# EAGLE design eggbothat3 (EAGLE 7.7.0)

## Sheet 1 of 2
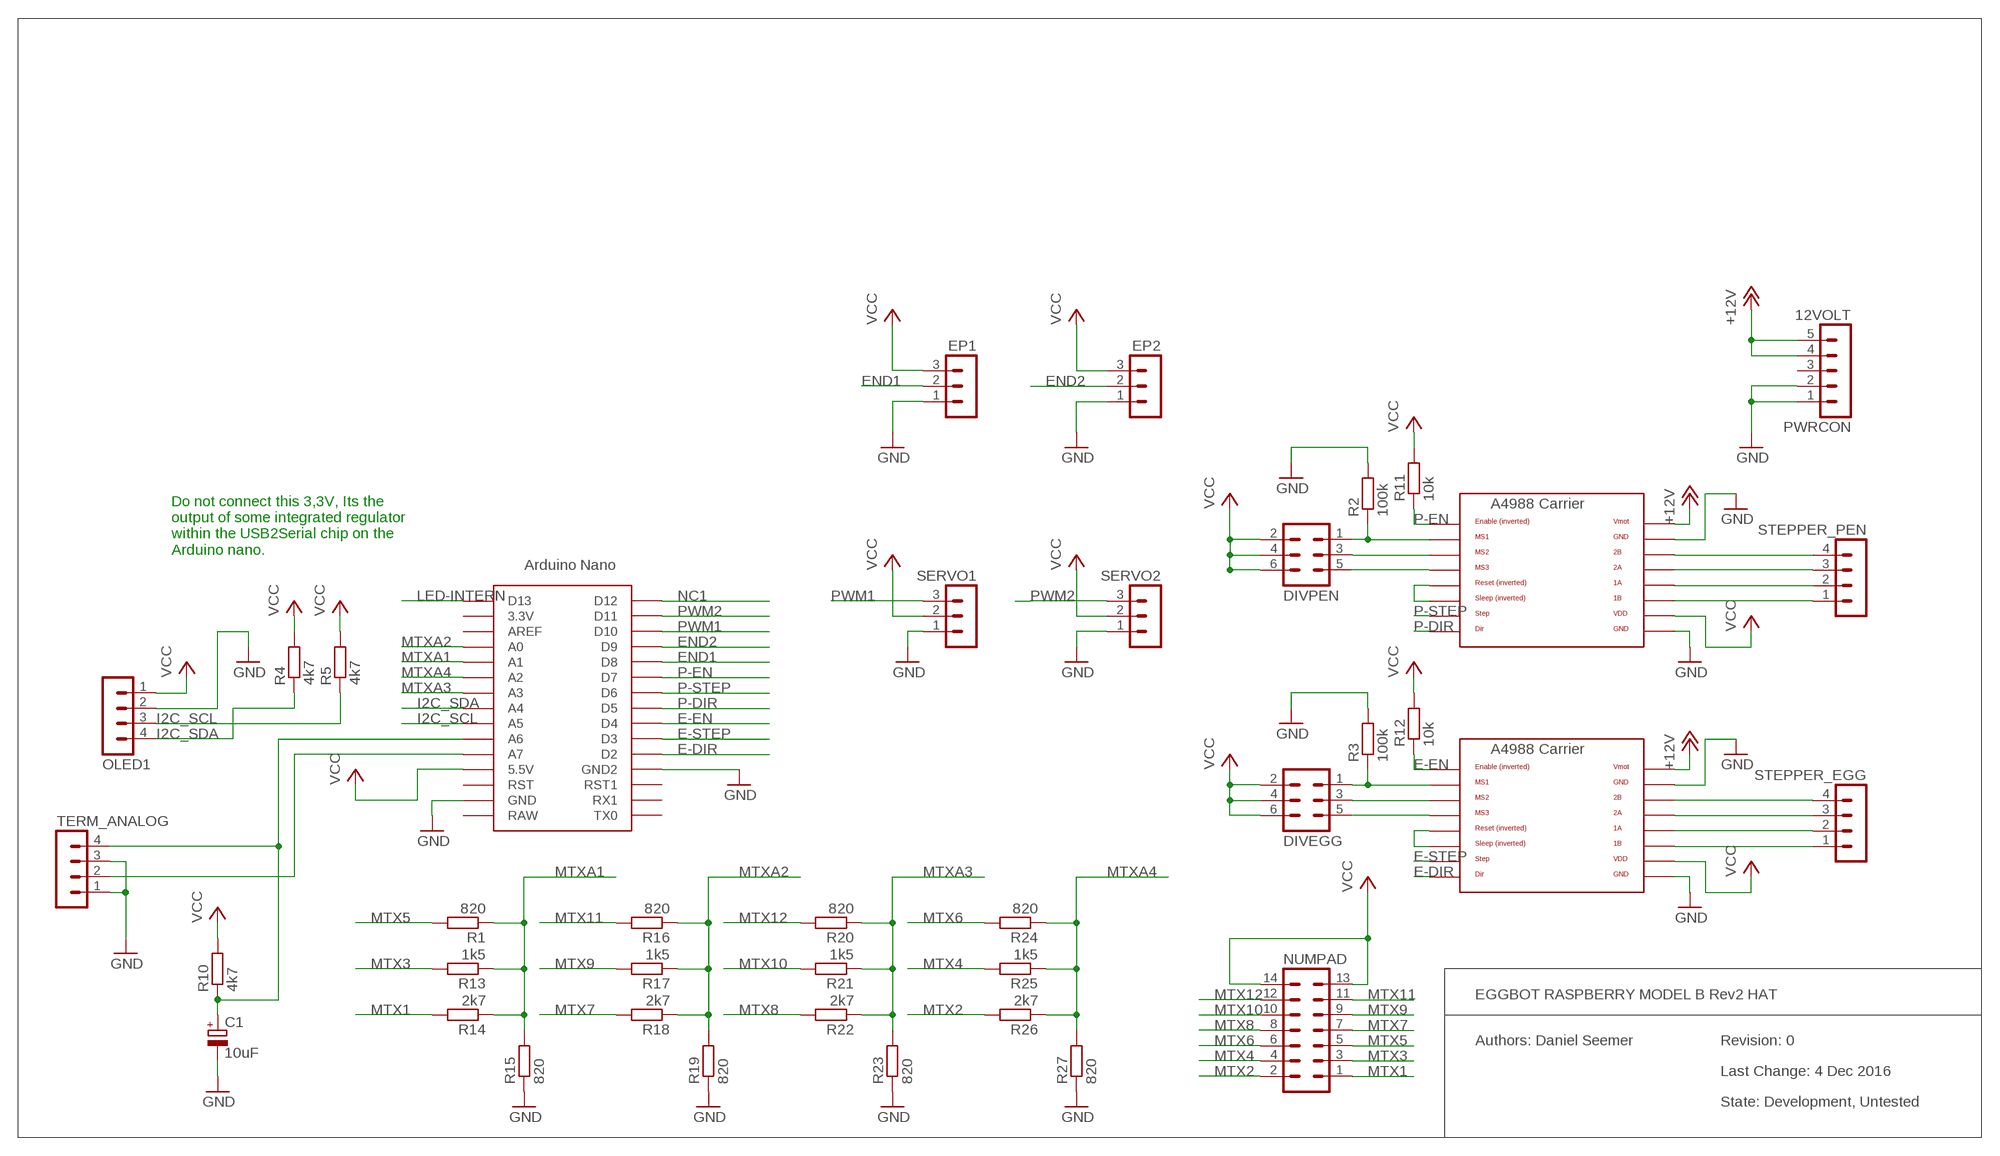
[diagram p0: schematic, sheet 1]

### Parts
12VOLT  PWRCON  MA05-1  [MA05-1]
C1  10uF  CPOL-EUE2.5-5  [E2,5-5]
DIVEGG  MA03-2  [MA03-2]
DIVPEN  MA03-2  [MA03-2]
EP1  MA03-1  [MA03-1]
EP2  MA03-1  [MA03-1]
NUMPAD  MA07-2  [MA07-2]
OLED1  MA04-1  [MA04-1]
R1  820  R-EU_R1206  [R1206]
R2  100k  R-EU_R1206  [R1206]
R3  100k  R-EU_R1206  [R1206]
R4  4k7  R-EU_R1206  [R1206]
R5  4k7  R-EU_R1206  [R1206]
R10  4k7  R-EU_R1206  [R1206]
R11  10k  R-EU_R1206  [R1206]
R12  10k  R-EU_R1206  [R1206]
R13  1k5  R-EU_R1206  [R1206]
R14  2k7  R-EU_R1206  [R1206]
R15  820  R-EU_R1206  [R1206]
R16  820  R-EU_R1206  [R1206]
R17  1k5  R-EU_R1206  [R1206]
R18  2k7  R-EU_R1206  [R1206]
R19  820  R-EU_R1206  [R1206]
R20  820  R-EU_R1206  [R1206]
R21  1k5  R-EU_R1206  [R1206]
R22  2k7  R-EU_R1206  [R1206]
R23  820  R-EU_R1206  [R1206]
R24  820  R-EU_R1206  [R1206]
R25  1k5  R-EU_R1206  [R1206]
R26  2k7  R-EU_R1206  [R1206]
R27  820  R-EU_R1206  [R1206]
SERVO1  MA03-1  [MA03-1]
SERVO2  MA03-1  [MA03-1]
STEPPER_EGG  MA04-1  [MA04-1]
STEPPER_PEN  MA04-1  [MA04-1]
TERM_ANALOG  MA04-1  [MA04-1]
U$1  A4988BREAKOUT  [A4988BREAKOUT]
U$2  A4988BREAKOUT  [A4988BREAKOUT]
U$4  NANO  [NANO]

### Nets
+12V: 12VOLT.4 12VOLT.5 U$1.VMOT U$2.VMOT
E-DIR: U$2.DIR U$4.D2
E-EN: R12.1 U$2.EN U$4.D4
E-STEP: U$2.STEP U$4.D3
END1: EP1.2 U$4.D8
END2: EP2.2 U$4.D9
GND: 12VOLT.1 12VOLT.2 C1.- EP1.1 EP2.1 OLED1.2 R2.2 R3.2 R15.1 R19.1 R23.1 R27.1 SERVO1.1 SERVO2.1 TERM_ANALOG.1 TERM_ANALOG.3 U$1.GND U$1.GND@0(GND) U$2.GND U$2.GND@0(GND) U$4.GND U$4.GND1(GND2)
I2C_SCL: OLED1.3 R5.1 U$4.A5
I2C_SDA: OLED1.4 R4.1 U$4.A4
LED-INTERN: U$4.D13
MTX1: NUMPAD.1 R14.2
MTX2: NUMPAD.2 R26.2
MTX3: NUMPAD.3 R13.2
MTX4: NUMPAD.4 R25.2
MTX5: NUMPAD.5 R1.2
MTX6: NUMPAD.6 R24.2
MTX7: NUMPAD.7 R18.2
MTX8: NUMPAD.8 R22.2
MTX9: NUMPAD.9 R17.2
MTX10: NUMPAD.10 R21.2
MTX11: NUMPAD.11 R16.2
MTX12: NUMPAD.12 R20.2
MTXA1: R1.1 R13.1 R14.1 R15.2 U$4.A1
MTXA2: R16.1 R17.1 R18.1 R19.2 U$4.A0
MTXA3: R20.1 R21.1 R22.1 R23.2 U$4.A3
MTXA4: R24.1 R25.1 R26.1 R27.2 U$4.A2
N$1: STEPPER_PEN.4 U$1.2B
N$2: STEPPER_PEN.3 U$1.2A
N$3: STEPPER_PEN.2 U$1.1A
N$4: STEPPER_PEN.1 U$1.1B
N$5: STEPPER_EGG.4 U$2.2B
N$6: STEPPER_EGG.3 U$2.2A
N$7: STEPPER_EGG.2 U$2.1A
N$8: STEPPER_EGG.1 U$2.1B
N$9: DIVPEN.3 U$1.MS2
N$10: DIVPEN.1 R2.1 U$1.MS1
N$11: DIVPEN.5 U$1.MS3
N$12: DIVEGG.3 U$2.MS2
N$13: DIVEGG.1 R3.1 U$2.MS1
N$14: DIVEGG.5 U$2.MS3
N$18: U$1.RST U$1.SLP(SLEEP)
N$19: U$2.RST U$2.SLP(SLEEP)
N$20: C1.+ R10.1 TERM_ANALOG.4 U$4.A6
N$21: TERM_ANALOG.2 U$4.A7
NC1: U$4.D12
P-DIR: U$1.DIR U$4.D5
P-EN: R11.1 U$1.EN U$4.D7
P-STEP: U$1.STEP U$4.D6
PWM1: SERVO1.3 U$4.D10
PWM2: SERVO2.3 U$4.D11
VCC: DIVEGG.2 DIVEGG.4 DIVEGG.6 DIVPEN.2 DIVPEN.4 DIVPEN.6 EP1.3 EP2.3 NUMPAD.13 NUMPAD.14 OLED1.1 R4.2 R5.2 R10.2 R11.2 R12.2 SERVO1.2 SERVO2.2 U$1.VDD U$2.VDD U$4.5V(5.5V)
Unconnected: 12VOLT.3 U$4.3.3V U$4.AREF U$4.RAW U$4.RST U$4.RST1 U$4.RX1 U$4.TX0

### Notes on the sheet
- Do not connect this 3,3V, Its the
  output of some integrated regulator
  within the USB2Serial chip on the
  Arduino nano.
- EGGBOT RASPBERRY MODEL B Rev2 HAT
- Authors: Daniel Seemer | Revision: 0
- Last Change: 4 Dec 2016
- State: Development, Untested

## Sheet 2 of 2

## Library data of the parts
12VOLT = con-lstb:MA05-1: PIN HEADER; OC_FARNELL: unknown; OC_NEWARK: unknown
C1 = rcl:CPOL-EU: POLARIZED CAPACITOR, European symbol
DIVEGG DIVPEN = con-lstb:MA03-2: PIN HEADER; OC_FARNELL: unknown; OC_NEWARK: unknown
EP1 EP2 SERVO1 SERVO2 = con-lstb:MA03-1: PIN HEADER; OC_FARNELL: unknown; OC_NEWARK: unknown
NUMPAD = con-lstb:MA07-2: PIN HEADER; OC_FARNELL: unknown; OC_NEWARK: unknown
OLED1 STEPPER_EGG STEPPER_PEN TERM_ANALOG = con-lstb:MA04-1: PIN HEADER; OC_FARNELL: unknown; OC_NEWARK: unknown
R1-R5 R10-R27 = rcl:R-EU_: RESISTOR, European symbol
U$1 U$2 = RepRapjr:A4988BREAKOUT
U$4 = levelshifter:NANO: Arduino Nano

## Board
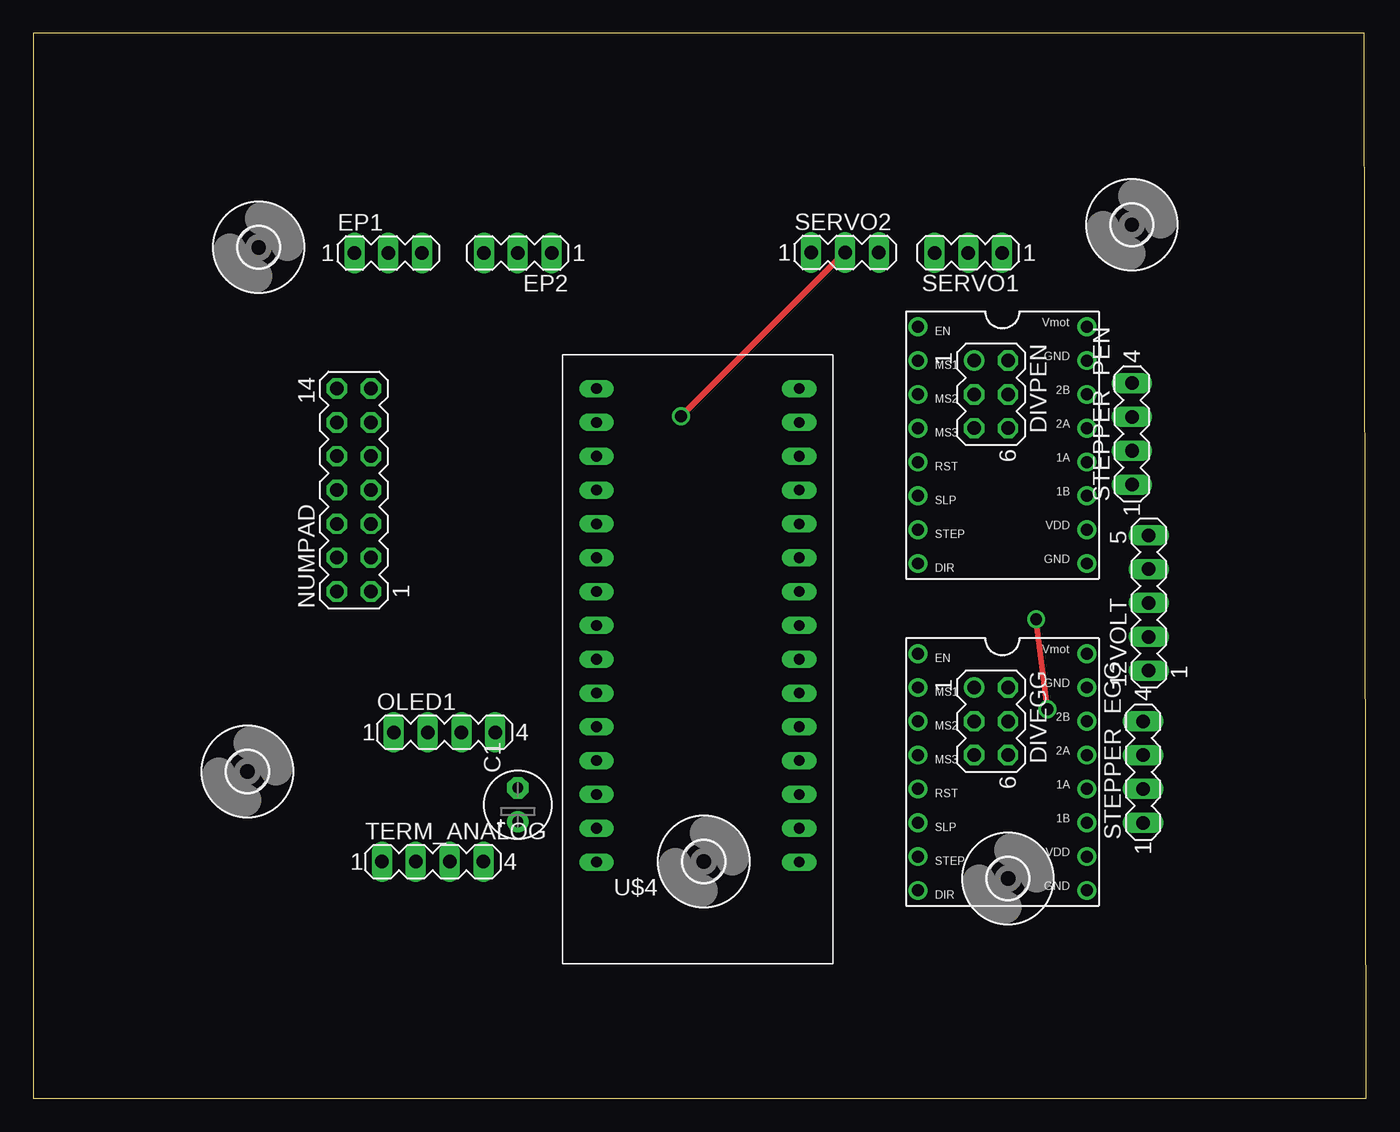
[diagram p1: board, top side]
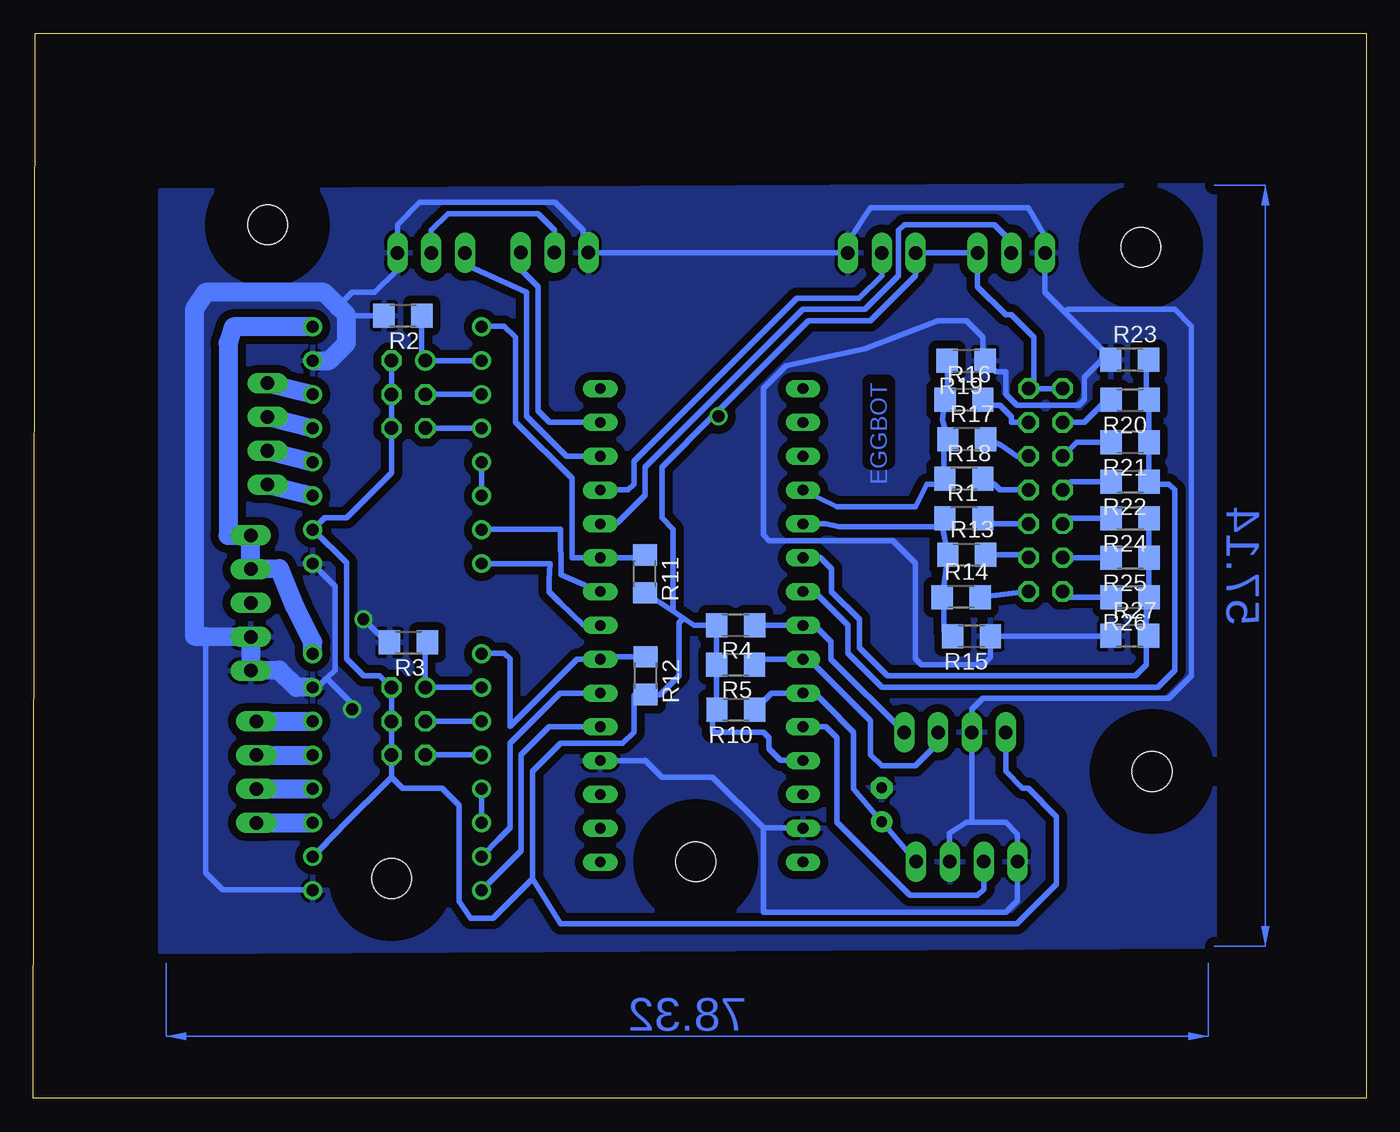
[diagram p2: board, bottom side, seen from below]

Size 100.16 x 80 mm. Coordinates in mm from the lower left corner, seen from the top.
Outline: 0,0 100.16,0 100,80 0,80 0,0
Copper layers (1*16): Top 0.035mm / dielectric 1.5mm / Bottom 0.035mm
Design rules "default": minimum track width 10mil, minimum drill 24mil, track to track 8mil, track to pad 8mil, pad to pad 8mil, via to via 8mil, smd to smd 8mil, copper to edge 40mil, drill to drill 8mil, minimum pad ring 10mil, minimum via ring 8mil, stop-mask expansion 4mil, vias tented up to drill 0mil, thermal gap 10mil

### Footprints (pad centres in the part's own frame; a part is rotated, then mirrored left to right if it is on the bottom)
MA05-1 = drill 1.016 long: 1 -5.08,0; 2 -2.54,0; 3 0,0; 4 2.54,0; 5 5.08,0
E2,5-5 = drill 0.813 pad 1.6: + -1.27,0 | drill 0.813 pad 1.6 octagon: - 1.27,0
MA03-2 = drill 1.016: 1 -2.54,-1.27 | drill 1.016 octagon: 2 -2.54,1.27; 3 0,-1.27; 4 0,1.27; 5 2.54,-1.27; 6 2.54,1.27
MA03-1 = drill 1.016 long: 1 -2.54,0; 2 0,0; 3 2.54,0
MA07-2 = drill 1.016 octagon: 1 -7.62,-1.27; 2 -7.62,1.27; 3 -5.08,-1.27; 4 -5.08,1.27; 5 -2.54,-1.27; 6 -2.54,1.27; 7 0,-1.27; 8 0,1.27; 9 2.54,-1.27; 10 2.54,1.27; 11 5.08,-1.27; 12 5.08,1.27; 13 7.62,-1.27; 14 7.62,1.27
MA04-1 = drill 1.016 long: 1 -3.81,0; 2 -1.27,0; 3 1.27,0; 4 3.81,0
R1206 = smd 1.6 x 1.803: 1 -1.422,0; 2 1.422,0
A4988BREAKOUT = drill 0.9: 1A 8.89,1.27; 1B 11.43,1.27; 2A 6.35,1.27; 2B 3.81,1.27; DIR 16.51,-11.43; EN -1.27,-11.43; GND 16.51,1.27; GND@0 1.27,1.27; MS1 1.27,-11.43; MS2 3.81,-11.43; MS3 6.35,-11.43; RST 8.89,-11.43; SLP 11.43,-11.43; STEP 13.97,-11.43; VDD 13.97,1.27; VMOT -1.27,1.27
3,0 = hole 3: 0,0
NANO = drill 0.8 long: 3.3V -10.16,24.13; 5V -10.16,-1.27; A0 -10.16,19.05; A1 -10.16,16.51; A2 -10.16,13.97; A3 -10.16,11.43; A4 -10.16,8.89; A5 -10.16,6.35; A6 -10.16,3.81; A7 -10.16,1.27; AREF -10.16,21.59; D2 5.08,1.27; D3 5.08,3.81; D4 5.08,6.35; D5 5.08,8.89; D6 5.08,11.43; D7 5.08,13.97; D8 5.08,16.51; D9 5.08,19.05; D10 5.08,21.59; D11 5.08,24.13; D12 5.08,26.67; D13 -10.16,26.67; GND -10.16,-6.35; GND1 5.08,-1.27; RAW -10.16,-8.89; RST -10.16,-3.81; RST1 5.08,-3.81; RX1 5.08,-6.35; TX0 5.08,-8.89

### Placement (x,y rotation side)
12VOLT  83.82,37.21 90 top
C1  36.41,22.05 90 top
DIVEGG  71.97,28.32 270 top
DIVPEN  71.97,52.87 270 top
EP1  26.67,63.5 0 top
EP2  36.41,63.5 180 top
NUMPAD  24.09,45.69 90 top
OLED1  30.9,27.5 0 top
R1  30.23,43.58 0 bottom
R2  72.39,58.8 180 bottom
R3  71.97,34.25 180 bottom
R4  47.38,35.55 180 bottom
R5  47.38,32.58 180 bottom
R10  47.36,29.2 180 bottom
R11  54.2,39.4 270 bottom
R12  54.14,31.75 270 bottom
R13  30.02,40.83 0 bottom
R14  30.44,37.65 0 bottom
R15  29.66,34.72 180 bottom
R16  30.23,52.47 0 bottom
R17  30.02,49.5 0 bottom
R18  30.23,46.54 0 bottom
R19  30.06,55.41 180 bottom
R20  17.74,52.47 180 bottom
R21  17.74,49.29 180 bottom
R22  17.74,46.33 180 bottom
R23  17.77,55.48 0 bottom
R24  17.74,43.58 180 bottom
R25  17.74,40.61 180 bottom
R26  17.74,37.65 180 bottom
R27  17.77,34.74 0 bottom
SERVO1  70.25,63.51 180 top
SERVO2  60.99,63.53 0 top
STEPPER_EGG  83.4,24.51 90 top
STEPPER_PEN  82.55,49.91 90 top
TERM_ANALOG  30.01,17.77 0 top
U$1  77.89,56.68 270 top
U$2  77.89,32.13 270 top
U$3  [3,0]  16.93,63.92 0 top
U$4  52.48,26.64 0 top
U$5  [3,0]  82.55,65.62 0 top
U$6  [3,0]  73.24,16.51 0 top
U$7  [3,0]  50.38,17.78 0 top
U$8  [3,0]  16.09,24.55 0 top

### Tracks (layer width: path | path; a pad name or v marks a point on that pad's centre or on a via)
+12V
  Bottom 1.422: U$2.VMOT 79.16,34.29 80.43,36.83 81.66,39.79 12VOLT.4 12VOLT.5 85.51,42.29 85.51,56.73 85.13,57.95 U$1.VMOT
E-DIR
  Bottom 0.406: U$4.D2 61.42,27.91 63.5,25.82 63.5,18.59 U$2.DIR
E-EN
  Bottom 0.406: R12.1 57.38,33.17 U$4.D4 59.3,32.99 64.35,27.94 64.31,29.6 64.35,32.6 64.35,33.02 64.77,33.44 66.42,33.44 U$2.EN
E-STEP
  Bottom 0.406: U$4.D3 60.57,30.45 64.35,26.67 64.35,20.32 65.19,19.47 66.42,18.2 U$2.STEP
END1
  Bottom 0.406: U$4.D8 57.53,43.18 56.3,43.18 54.19,45.3 54.19,47.41 42.33,59.27 37.68,59.27 35.14,61.81 35.14,65.19 34.71,65.62 27.94,65.62 26.67,64.35 EP1.2
END2
  Bottom 0.406: EP2.2 36.41,61.81 38.1,60.11 42.76,60.11 55.03,47.84 55.03,46.14 55.46,45.72 57.53,45.72 U$4.D9
GND  (via drill 0.9)
  Top 0.406: v75.35,35.98 v76.2,29.21
  Bottom 0.406: R27.1 19.47,34.7 28.78,34.7 R15.1 28.23,33.13 28.78,32.59 33.43,32.59 33.86,33.01 33.86,40.2 35.55,41.9 44.86,41.9 45.3,42.33 45.3,53.34 43.6,55.03 37.68,56.3 32.17,58.42 30.06,58.42 28.79,57.15 28.79,55.56 R19.1 27.82,54.59 27.09,54.59 27.09,52.9 26.24,52.05 21.59,52.05 21.16,52.48 21.16,54.17 19.85,55.48 | R23.1 19.85,55.48 | 30.05,20.74 29.63,20.75 OLED1.2 29.63,29.21 29.21,29.63 | 30.05,20.74 31.32,19.93 TERM_ANALOG.3 | 30.05,20.74 27.09,20.74 26.2,19.85 TERM_ANALOG.1 26.2,14.86 27.09,13.97 45.3,13.97 45.3,20.32 | U$1.GND 77.47,38.48 77.47,32.17 78.11,31.54 | 78.11,31.54 78.78,30.86 U$2.GND@0 | 45.3,20.32 49.11,24.13 52.92,24.13 54.19,25.4 54.22,25.37 U$4.GND1 57.6,25.4 | U$2.GND 79.21,15.66 85.94,15.66 87.2,16.93 87.2,34.7 | U$4.GND 42.36,20.32 45.3,20.32 | 77.26,59.48 76.2,60.54 74.51,60.54 72.8,62.25 SERVO1.1 72.8,65.64 71.12,67.31 60.96,67.31 58.84,65.19 58.84,63.92 SERVO2.1 58.42,63.5 EP2.1 | R2.2 76.58,58.8 76.62,58.84 | EP2.1 38.95,64.35 37.25,66.89 25.4,66.89 24.13,64.77 EP1.1 24.13,60.54 22.65,59.05 | EP2.1 | 19.85,55.48 19.85,56.26 22.65,59.05 | 29.21,29.63 | 29.21,29.63 28.79,30.06 14.82,30.06 13.12,31.75 13.12,58 14.39,59.27 22.44,59.27 22.65,59.05 | v75.35,35.98 73.66,34.29 R3.2 | v76.2,29.21 76.2,29.63 78.11,31.54
  Bottom 1.422: U$2.GND@0 80.39,30.86 81.7,32.17 81.66,32.17 12VOLT.1 12VOLT.2 87.2,34.7 88.05,34.71 88.05,59.27 87.21,60.54 78.32,60.54 77.26,59.48 76.62,58.84 76.62,56.73 77.94,55.41 U$1.GND@0
  pour Bottom (isolate 0.61): 11.43,68.58 11.43,11.43 90.59,11.01 90.59,68.16
I2C_SCL
  Bottom 0.406: OLED1.3 32.16,27.49 32.16,26.66 33.86,24.97 36.4,24.97 37.24,25.82 37.24,28.36 41.9,33.01 41.92,32.99 U$4.A5 45.56,32.99 R5.1
I2C_SDA
  Bottom 0.406: OLED1.4 40.21,32.99 40.21,34.28 41.45,35.53 U$4.A4 45.94,35.53 R4.1
MTX1
  Bottom 0.406: R14.2 NUMPAD.1
MTX2
  Bottom 0.406: R26.2 22.82,37.65 NUMPAD.2
MTX3
  Bottom 0.406: R13.2 25.57,40.83 NUMPAD.3
MTX4
  Bottom 0.406: R25.2 NUMPAD.4 | NUMPAD.4
MTX5
  Bottom 0.406: R1.2 27.92,43.15 27.09,43.17 25.37,43.17 NUMPAD.5
MTX6
  Bottom 0.406: R24.2 22.4,43.58 NUMPAD.6
MTX7
  Bottom 0.406: R18.2 27.92,46.12 27.93,46.13 27.51,45.71 25.77,45.71 NUMPAD.7
MTX8
  Bottom 0.406: R22.2 22.18,46.33 NUMPAD.8
MTX9
  Bottom 0.406: R17.2 27.5,49.08 26.24,48.24 25.37,48.24 NUMPAD.9
MTX10
  Bottom 0.406: R21.2 21.76,49.29 NUMPAD.10
MTX11
  Bottom 0.406: NUMPAD.11 26.65,50.77 26.66,50.78 26.66,51.21 27.51,52.05 28.39,52.05 R16.2
MTX12
  Bottom 0.406: R20.2 19.48,52.47 21.16,50.78 22.81,50.78 NUMPAD.12
MTXA1
  Bottom 0.406: 31.86,42.94 R13.1 R14.1 31.74,37.24 31.74,35.13 R15.2 | 31.86,42.94 R1.1 | 31.86,42.94 39.58,42.94 40.63,43.17 42.3,43.17 U$4.A1
MTXA2
  Bottom 0.406: 31.74,46.13 31.74,48.67 R17.1 31.86,50.99 R16.1 31.48,52.64 R19.2 | 31.74,46.13 R18.1 | 31.74,46.13 33.01,46.13 33.86,44.44 39.76,44.44 U$4.A0
MTXA3
  Bottom 0.406: R21.1 R22.1 16.12,46.13 14.81,46.13 14.39,45.71 14.39,32.16 15.66,30.89 36.4,30.89 38.94,33.44 38.94,35.55 41.45,38.07 U$4.A3 | R21.1 | R21.1 R20.1 | R20.1 | R23.2 16.51,55.44 16.51,52.48 R20.1
MTXA4
  Bottom 0.406: R24.1 R25.1 R26.1 16.51,37.24 16.51,35.13 R27.2 16.51,34.58 16.51,32.59 17.35,31.74 35.97,31.74 38.09,33.86 38.09,35.97 40.19,38.07 40.19,39.76 41.06,40.64 U$4.A2 | R24.1
N$1
  Bottom 0.406: U$1.2B
  Bottom 1.422: STEPPER_PEN.4 U$1.2B
N$2
  Bottom 0.406: U$1.2A
  Bottom 1.422: STEPPER_PEN.3 U$1.2A
N$3
  Bottom 0.406: U$1.1A
  Bottom 1.422: STEPPER_PEN.2 U$1.1A
N$4
  Bottom 0.406: U$1.1B
  Bottom 1.422: STEPPER_PEN.1 U$1.1B
N$5
  Bottom 0.406: U$2.2B
  Bottom 1.422: STEPPER_EGG.4 U$2.2B
N$6
  Bottom 0.406: U$2.2A
  Bottom 1.422: STEPPER_EGG.3 U$2.2A
N$7
  Bottom 1.422: STEPPER_EGG.2 U$2.1A
N$8
  Bottom 1.422: STEPPER_EGG.1 U$2.1B
N$9
  Bottom 0.406: U$1.MS2 DIVPEN.3 | DIVPEN.3
N$10
  Bottom 0.406: U$1.MS1 DIVPEN.1 | DIVPEN.1 | R2.1 70.97,55.69 DIVPEN.1
N$11
  Bottom 0.406: U$1.MS3 DIVPEN.5 | DIVPEN.5
N$12
  Bottom 0.406: U$2.MS2 DIVEGG.3 | DIVEGG.3
N$13
  Bottom 0.406: U$2.MS1 DIVEGG.1 | DIVEGG.1 | DIVEGG.1 70.7,34.1 R3.1
N$14
  Bottom 0.406: U$2.MS3 66.46,25.82 70.66,25.82 DIVEGG.5
N$18
  Bottom 0.406: U$1.SLP U$1.RST
N$19
  Bottom 0.406: U$2.SLP U$2.RST
N$20
  Bottom 0.406: R10.1 44.69,30.45 U$4.A6 42.3,30.45 41.48,30.47 40.63,29.63 38.51,27.51 38.51,23.24 C1.+ 36.33,20.7 TERM_ANALOG.4
N$21
  Bottom 0.406: TERM_ANALOG.2 28.74,15.7 29.2,15.24 34.28,15.24 39.78,20.74 39.78,27.09 40.6,27.91 40.63,27.91 U$4.A7
P-DIR
  Bottom 0.406: U$4.D5 58.84,35.56 60.57,37.22 61.39,38.07 61.38,38.95 61.34,40.17 U$1.DIR
P-EN
  Bottom 0.406: U$1.EN 66.42,58 64.77,58 63.92,57.15 63.92,50.8 59.69,46.57 59.69,40.64 59.66,40.61 U$4.D7 54.83,40.61 R11.1
P-STEP
  Bottom 0.406: U$4.D6 60.5,39.34 60.54,42.76 63.08,42.76 64.77,42.76 66.42,42.76 U$1.STEP
PWM1
  Bottom 0.406: U$4.D10 60.08,48.23 63.08,51.22 63.08,60.54 67.73,62.65 67.73,63.49 SERVO1.3
PWM2
  Bottom 0.406: U$4.D11 61.35,50.77 62.23,51.65 62.23,60.96 63.5,62.23 63.5,63.5 SERVO2.3
VCC  (via drill 0.9)
  Top 0.406: v48.68,51.22 60.96,63.5 SERVO2.2
  Bottom 0.406: NUMPAD.14 NUMPAD.13 24.98,53.7 24.98,57.15 26.67,58.84 27.09,58.84 29.21,60.96 EP1.3 EP2.3 | R4.2 R5.2 | R5.2 | R5.2 48.8,29.22 | 48.8,29.22 R10.2 | U$2.VDD 77.05,20.28 77.05,20.32 73.24,24.13 | 73.24,24.13 DIVEGG.6 DIVEGG.4 DIVEGG.2 74.13,31.75 75.35,31.75 76.62,33.02 76.62,40.22 79.12,42.71 U$1.VDD 78.28,43.6 76.62,43.6 73.24,46.99 DIVPEN.6 73.24,50.38 DIVPEN.4 | U$4.5V 42.36,25.4 44.03,25.4 | 44.03,25.4 | 44.03,25.4 44.87,26.25 44.87,27.09 45.3,27.52 49.11,27.52 49.11,29.21 48.81,29.21 48.8,29.22 | SERVO2.2 60.99,65.22 62.23,66.46 69,66.46 70.27,65.19 70.27,63.53 SERVO1.2 | EP2.3 | R4.2 50.49,35.55 51.31,36.08 | 51.31,36.08 51.89,36.46 | 51.89,36.46 R11.2 | 62.65,16.51 62.65,18.63 62.65,24.55 60.54,26.67 55.88,26.67 55.03,27.52 55.03,30.29 R12.2 53.07,30.33 51.65,31.75 51.65,35.74 51.31,36.08 | 62.65,16.51 65.62,13.55 67.31,13.55 68.16,14.82 68.16,22.01 69.43,23.28 72.39,23.28 73.24,24.13 | OLED1.1 27.09,24.55 25.82,23.28 25.4,23.28 23.28,21.17 23.28,16.09 26.25,13.12 60.54,13.12 62.65,16.51 | EP2.3 33.87,61.81 37.25,58.42 41.91,58.42 48.68,51.65 | 48.68,51.65 v48.68,51.22 | v48.68,51.22 49.11,51.22 52.92,47.41 52.92,43.6 52.07,42.76 52.07,36.64 51.89,36.46 | v48.68,51.22 48.68,51.65 | 49.11,35.85 R4.2 | EP2.3 | DIVPEN.2 DIVPEN.4 | DIVPEN.4
(copper drawn outside any net)
  shapes: Bottom area x2

### Text on the board
Bottom: EGGBOT
Document: Phaiax | Eggbot V1 / 2016-12-11